# Altium schematic sheet Sheet1.SchDoc
size A4; SheetNumber: 1; SheetTotal: 1
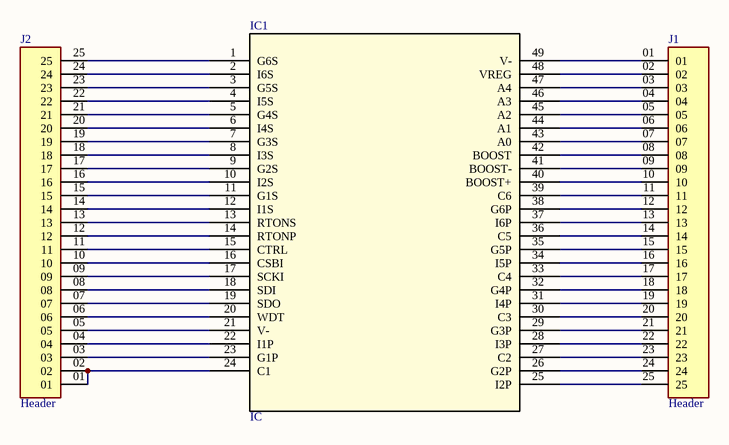
[diagram p0: Sheet1.SchDoc]

## Parts
IC1  IC  [LQFP-48_LXE_LIT]
J1  Header  [SAMTEC_TS-125-G-A]
J2  Header  [SAMTEC_TS-125-G-A]

## Nets
NetIC1_1: IC1.1(G6S) J2.25
NetIC1_2: IC1.2(I6S) J2.24
NetIC1_3: IC1.3(G5S) J2.23
NetIC1_4: IC1.4(I5S) J2.22
NetIC1_5: IC1.5(G4S) J2.21
NetIC1_6: IC1.6(I4S) J2.20
NetIC1_7: IC1.7(G3S) J2.19
NetIC1_8: IC1.8(I3S) J2.18
NetIC1_9: IC1.9(G2S) J2.17
NetIC1_10: IC1.10(I2S) J2.16
NetIC1_11: IC1.11(G1S) J2.15
NetIC1_12: IC1.12(I1S) J2.14
NetIC1_13: IC1.13(RTONS) J2.13
NetIC1_14: IC1.14(RTONP) J2.12
NetIC1_15: IC1.15(CTRL) J2.11
NetIC1_16: IC1.16(CSBI) J2.10
NetIC1_17: IC1.17(SCKI) J2.09
NetIC1_18: IC1.18(SDI) J2.08
NetIC1_19: IC1.19(SDO) J2.07
NetIC1_20: IC1.20(WDT) J2.06
NetIC1_21: IC1.21(V-) J2.05
NetIC1_22: IC1.22(I1P) J2.04
NetIC1_23: IC1.23(G1P) J2.03
NetIC1_24: IC1.24(C1) J2.01 J2.02
NetIC1_25: IC1.25(I2P) J1.25
NetIC1_26: IC1.26(G2P) J1.24
NetIC1_27: IC1.27(C2) J1.23
NetIC1_28: IC1.28(I3P) J1.22
NetIC1_29: IC1.29(G3P) J1.21
NetIC1_30: IC1.30(C3) J1.20
NetIC1_31: IC1.31(I4P) J1.19
NetIC1_32: IC1.32(G4P) J1.18
NetIC1_33: IC1.33(C4) J1.17
NetIC1_34: IC1.34(I5P) J1.16
NetIC1_35: IC1.35(G5P) J1.15
NetIC1_36: IC1.36(C5) J1.14
NetIC1_37: IC1.37(I6P) J1.13
NetIC1_38: IC1.38(G6P) J1.12
NetIC1_39: IC1.39(C6) J1.11
NetIC1_40: IC1.40(BOOST+) J1.10
NetIC1_41: IC1.41(BOOST-) J1.09
NetIC1_42: IC1.42(BOOST) J1.08
NetIC1_43: IC1.43(A0) J1.07
NetIC1_44: IC1.44(A1) J1.06
NetIC1_45: IC1.45(A2) J1.05
NetIC1_46: IC1.46(A3) J1.04
NetIC1_47: IC1.47(A4) J1.03
NetIC1_48: IC1.48(VREG) J1.02
NetIC1_49: IC1.49(V-) J1.01